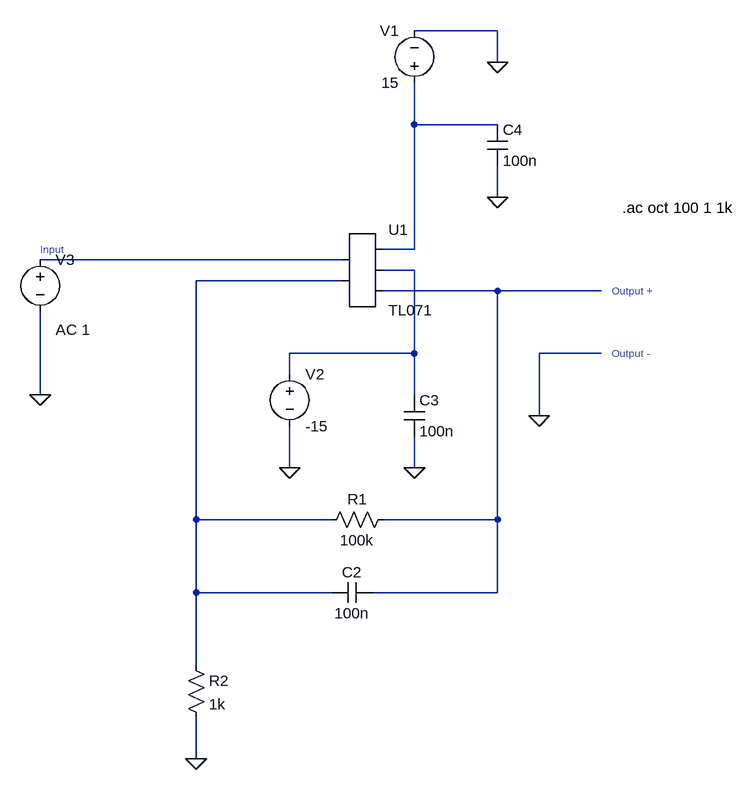
[diagram p0: schematic Trinn3(TL071).asc]
Trinn3(TL071).asc, the LTspice schematic file:
Version 4
SHEET 1 896 900
WIRE 480 -240 352 -240
WIRE 480 -192 480 -240
WIRE 352 -96 352 -160
WIRE 480 -96 352 -96
WIRE 480 16 480 -32
WIRE 352 96 352 -96
WIRE 352 96 304 96
WIRE 240 112 -224 112
WIRE 352 128 304 128
WIRE 240 144 16 144
WIRE 480 160 304 160
WIRE 640 160 480 160
WIRE 352 256 352 128
WIRE 352 256 160 256
WIRE 640 256 544 256
WIRE 160 288 160 256
WIRE -224 320 -224 192
WIRE 352 320 352 256
WIRE 544 352 544 256
WIRE 160 432 160 368
WIRE 352 432 352 384
WIRE 16 512 16 144
WIRE 224 512 16 512
WIRE 480 512 480 160
WIRE 480 512 304 512
WIRE 16 624 16 512
WIRE 224 624 16 624
WIRE 480 624 480 512
WIRE 480 624 288 624
WIRE 16 736 16 624
WIRE 16 880 16 816
FLAG 544 352 0
FLAG 16 880 0
FLAG 352 432 0
FLAG 480 16 0
FLAG 480 -192 0
FLAG 160 432 0
FLAG -224 320 0
SYMBOL AutoGenerated\\TL071 272 128 R0
SYMATTR InstName U1
SYMBOL res 0 720 R0
SYMATTR InstName R2
SYMATTR Value 1k
SYMBOL res 320 496 R90
WINDOW 0 0 56 VBottom 2
WINDOW 3 32 56 VTop 2
SYMATTR InstName R1
SYMATTR Value 100k
SYMBOL cap 288 608 R90
WINDOW 0 0 32 VBottom 2
WINDOW 3 32 32 VTop 2
SYMATTR InstName C2
SYMATTR Value 100n
SYMBOL cap 336 320 R0
SYMATTR InstName C3
SYMATTR Value 100n
SYMBOL cap 464 -96 R0
SYMATTR InstName C4
SYMATTR Value 100n
SYMBOL voltage 352 -144 R180
WINDOW 0 24 96 Left 2
WINDOW 3 24 16 Left 2
WINDOW 123 0 0 Left 0
WINDOW 39 0 0 Left 0
SYMATTR InstName V1
SYMATTR Value 15
SYMBOL voltage 160 272 R0
WINDOW 123 0 0 Left 0
WINDOW 39 0 0 Left 0
SYMATTR InstName V2
SYMATTR Value -15
SYMBOL voltage -224 96 R0
WINDOW 123 24 124 Left 2
WINDOW 39 0 0 Left 0
SYMATTR Value2 AC 1
SYMATTR InstName V3
SYMATTR Value ""
TEXT 656 160 Left 1 ;Output +
TEXT -224 96 Left 1 ;Input
TEXT 656 256 Left 1 ;Output -
TEXT 672 32 Left 2 !.ac oct 100 1 1k

The netlist it stands for:
* Trinn3(TL071).asc
* U1: TL071 (symbol AutoGenerated\TL071 not available, pins judged from their places): pin1=N002 pin2=N004 pin3=N001 pin4=N003 pin5=N005
R2 N004 0 1k
R1 N005 N004 100k
C2 N005 N004 100n
C3 N003 0 100n
C4 N001 0 100n
V1 N001 0 15
V2 N003 0 -15
V3 N002 0 AC 1
* Output +
* Input
* Output -
.ac oct 100 1 1k
.backanno
.end